# EAGLE design modulator (EAGLE 6.5.0)
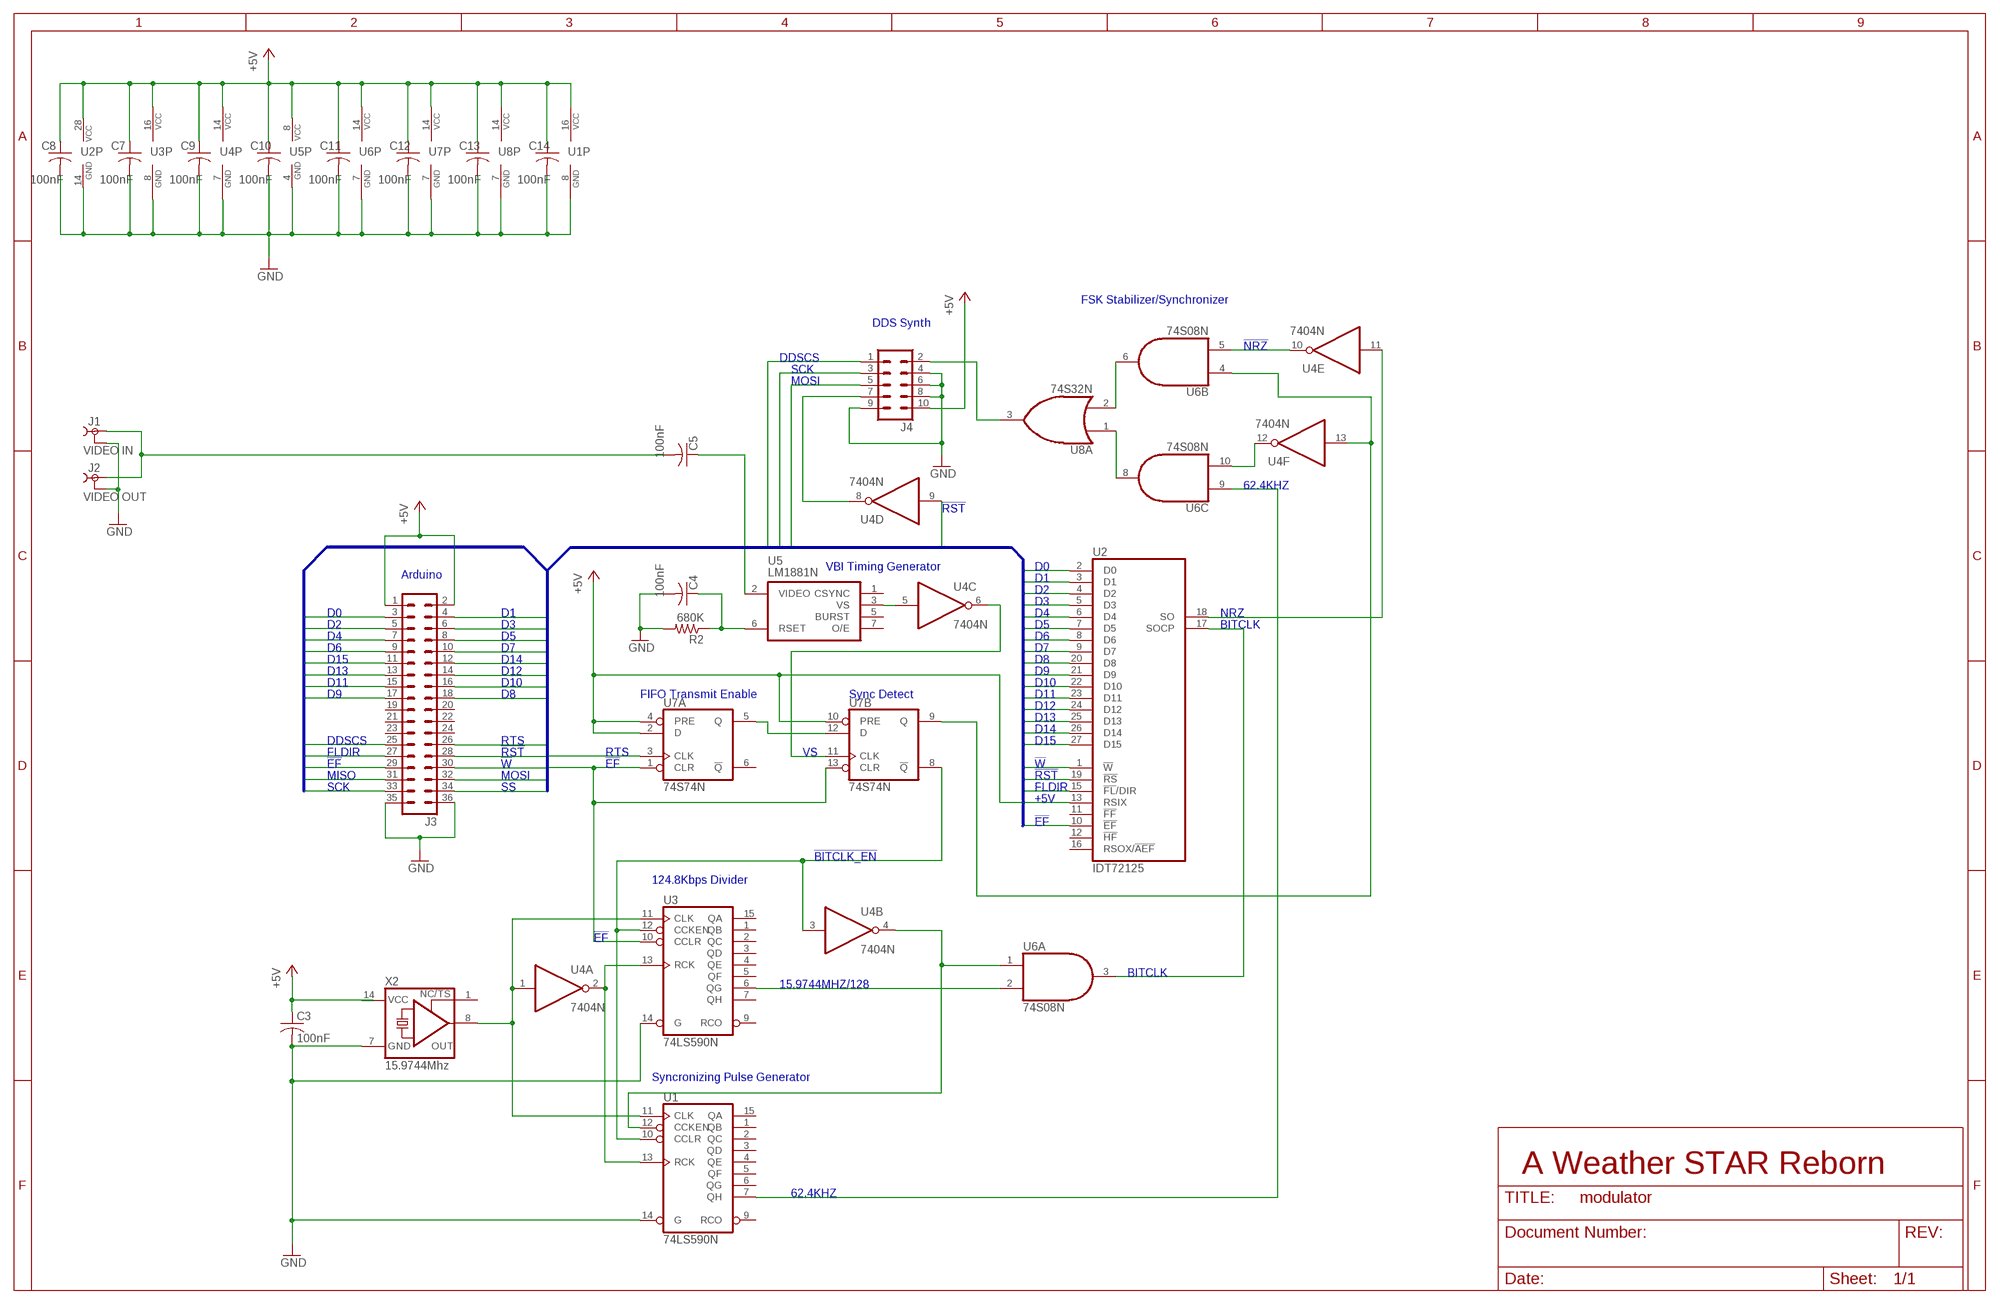
[diagram p0: schematic, sheet 1]

## Parts
C3  100nF  C-US050-025X075  [C050-025X075]
C4  100nF  C-US050-025X075  [C050-025X075]
C5  100nF  C-US050-025X075  [C050-025X075]
C7  100nF  C-US050-025X075  [C050-025X075]
C8  100nF  C-US050-025X075  [C050-025X075]
C9  100nF  C-US050-025X075  [C050-025X075]
C10  100nF  C-US050-025X075  [C050-025X075]
C11  100nF  C-US050-025X075  [C050-025X075]
C12  100nF  C-US050-025X075  [C050-025X075]
C13  100nF  C-US050-025X075  [C050-025X075]
C14  100nF  C-US050-025X075  [C050-025X075]
J1  VIDEO IN  TOBU3  [TOBU3]
J2  VIDEO OUT  TOBU3  [TOBU3]
J3  MA18-2  [MA18-2]
J4  MA05-2  [MA05-2]
R2  680K  R-US_0207/12  [0207/12]
U1  74LS590N  [DIL16]
U2  IDT72125  72125  [SO28L]
U3  74LS590N  [DIL16]
U4  7404N  [DIL14]
U5  LM1881N  [DIL08]
U6  74S08N  [DIL14]
U7  74S74N  [DIL14]
U8  74S32N  [DIL14]
X2  15.9744Mhz  XO-14  [DIL14S]

## Nets
15.9744MHZ/128: U3.6(QG) U6.2(A:I1)
62.4KHZ: U1.7(QH) U6.9(C:I0)
!BITCLK_EN: U1.10(CCLR) U3.12(CCKEN) U4.3(B:I) U7.8(B:!Q)
!EF: J3.29 U2.10(!EF) U3.10(CCLR) U7.1(A:CLR) U7.13(B:CLR)
!NRZ: U4.10(E:O) U6.5(B:I1)
!RST: J3.28 U2.19(!RS) U4.9(D:I)
!W: J3.30 U2.1(!W)
+5V: C3.1 C7.1 C8.1 C9.1 C10.1 C11.1 C12.1 C13.1 C14.1 J3.1 J3.2 J4.10 U1.16(VCC) U2.13(RSIX) U2.28(VCC) U3.16(VCC) U4.14(P:VCC) U5.8(VCC) U6.14(P:VCC) U7.2(A:D) U7.4(A:PRE) U7.10(B:PRE) U7.14(P:VCC) U8.14(P:VCC) X2.14(VCC)
BITCLK: U2.17(SOCP) U6.3(A:O)
D0: J3.3 U2.2(D0)
D1: J3.4 U2.3(D1)
D2: J3.5 U2.4(D2)
D3: J3.6 U2.5(D3)
D4: J3.7 U2.6(D4)
D5: J3.8 U2.7(D5)
D6: J3.9 U2.8(D6)
D7: J3.10 U2.9(D7)
D8: J3.18 U2.20(D8)
D9: J3.17 U2.21(D9)
D10: J3.16 U2.22(D10)
D11: J3.15 U2.23(D11)
D12: J3.14 U2.24(D12)
D13: J3.13 U2.25(D13)
D14: J3.12 U2.26(D14)
D15: J3.11 U2.27(D15)
DDSCS: J3.25 J4.1
FLDIR: J3.27 U2.15(!FL!/DIR)
GND: C3.2 C4.2 C7.2 C8.2 C9.2 C10.2 C11.2 C12.2 C13.2 C14.2 J1.2 J1.2@1 J1.2@2 J2.2 J2.2@1 J2.2@2 J3.35 J3.36 J4.4 J4.6 J4.8 J4.9 R2.2 U1.8(GND) U1.14(G) U2.14(GND) U3.8(GND) U3.14(G) U4.7(P:GND) U5.4(GND) U6.7(P:GND) U7.7(P:GND) U8.7(P:GND) X2.7(GND)
MISO: J3.31
MOSI: J3.32 J4.5
N$1: J4.7 U4.8(D:O)
N$2: J4.2 U8.3(A:O)
N$3: U1.11(CLK) U3.11(CLK) U4.1(A:I) X2.8(OUT)
N$4: U1.13(RCK) U3.13(RCK) U4.2(A:O)
N$5: U1.12(CCKEN) U4.4(B:O) U6.1(A:I0)
N$6: U4.13(F:I) U6.4(B:I0) U7.9(B:Q)
N$7: C5.2 J1.1 J2.1
N$8: U7.5(A:Q) U7.12(B:D)
N$9: U4.5(C:I) U5.3(VS)
N$10: U4.12(F:O) U6.10(C:I1)
N$11: C4.1 R2.1 U5.6(RSET)
N$12: U6.6(B:O) U8.2(A:I1)
N$13: C5.1 U5.2(VIDEO)
N$14: U6.8(C:O) U8.1(A:I0)
NRZ: U2.18(SO) U4.11(E:I)
RTS: J3.26 U7.3(A:CLK)
SCK: J3.33 J4.3
SS: J3.34
VS: U4.6(C:O) U7.11(B:CLK)
Unconnected: J3.19 J3.20 J3.21 J3.22 J3.23 J3.24 U1.1(QB) U1.2(QC) U1.3(QD) U1.4(QE) U1.5(QF) U1.6(QG) U1.9(RCO) U1.15(QA) U2.11(!FF) U2.12(!HF) U2.16(RSOX/!AEF) U3.1(QB) U3.2(QC) U3.3(QD) U3.4(QE) U3.5(QF) U3.7(QH) U3.9(RCO) U3.15(QA) U5.1(CSYNC) U5.5(BURST) U5.7(O/E) U6.11(D:O) U6.12(D:I0) U6.13(D:I1) U7.6(A:!Q) U8.4(B:I0) U8.5(B:I1) U8.6(B:O) U8.8(C:O) U8.9(C:I0) U8.10(C:I1) U8.11(D:O) U8.12(D:I0) U8.13(D:I1) X2.1(TS)

## Buses
D0,D1,D2,D3,D4,D5,D6,D7,D8,D9,D10,D11,D12,D13,D14,D15,!W,!EF,!RST,FLDIR,RTS,MOSI,MISO,SCK,SS,RFON,DDSCS

## Notes on the sheet
- FSK Stabilizer/Synchronizer
- DDS Synth
- VBI Timing Generator
- Arduino
- FIFO Transmit Enable | Sync Detect
- 124.8Kbps Divider
- Syncronizing Pulse Generator
- A Weather STAR Reborn

## Library data of the parts
C3-C5 C7-C14 = rcl:C-US: CAPACITOR, American symbol
J1 J2 = con-hirschmann custom:TOBU3: Female Cinch CONNECTOR ( RCA Jack ); MF: FARNELL; MPN: TOBU 3; OC_FARNELL: 592791; OC_NEWARK: 06WX5914
J3 = con-lstb:MA18-2: PIN HEADER; OC_FARNELL: unknown; OC_NEWARK: unknown
J4 = con-lstb:MA05-2: PIN HEADER; OC_FARNELL: unknown; OC_NEWARK: unknown
R2 = rcl:R-US_: RESISTOR, American symbol
U1 U3 = 74xx-us:74*590: 8-bit binary COUNTER, output register
U2 = mylib:72125: FIFO MEMORY
U4 = 74xx-us:74*04: Hex INVERTER
U5 = oldchips2:LM1881: Video sync separator
U6 = 74xx-us:74*08: Quad 2-input AND gate
U7 = 74xx-us:74*74: Dual D type positive edge triggered FLIP FLOP, preset and clear
U8 = 74xx-us:74*32: Quad 2-input OR gate
X2 = crystal:XO-: CRYSTAL; OC_FARNELL: unknown; OC_NEWARK: unknown

## Net classes
1 power: width 0.152 mm, drill 0.61 mm, clearance 0.152 mm
2 VIN: width 0.305 mm, drill 0.61 mm, clearance 0.152 mm

## Board
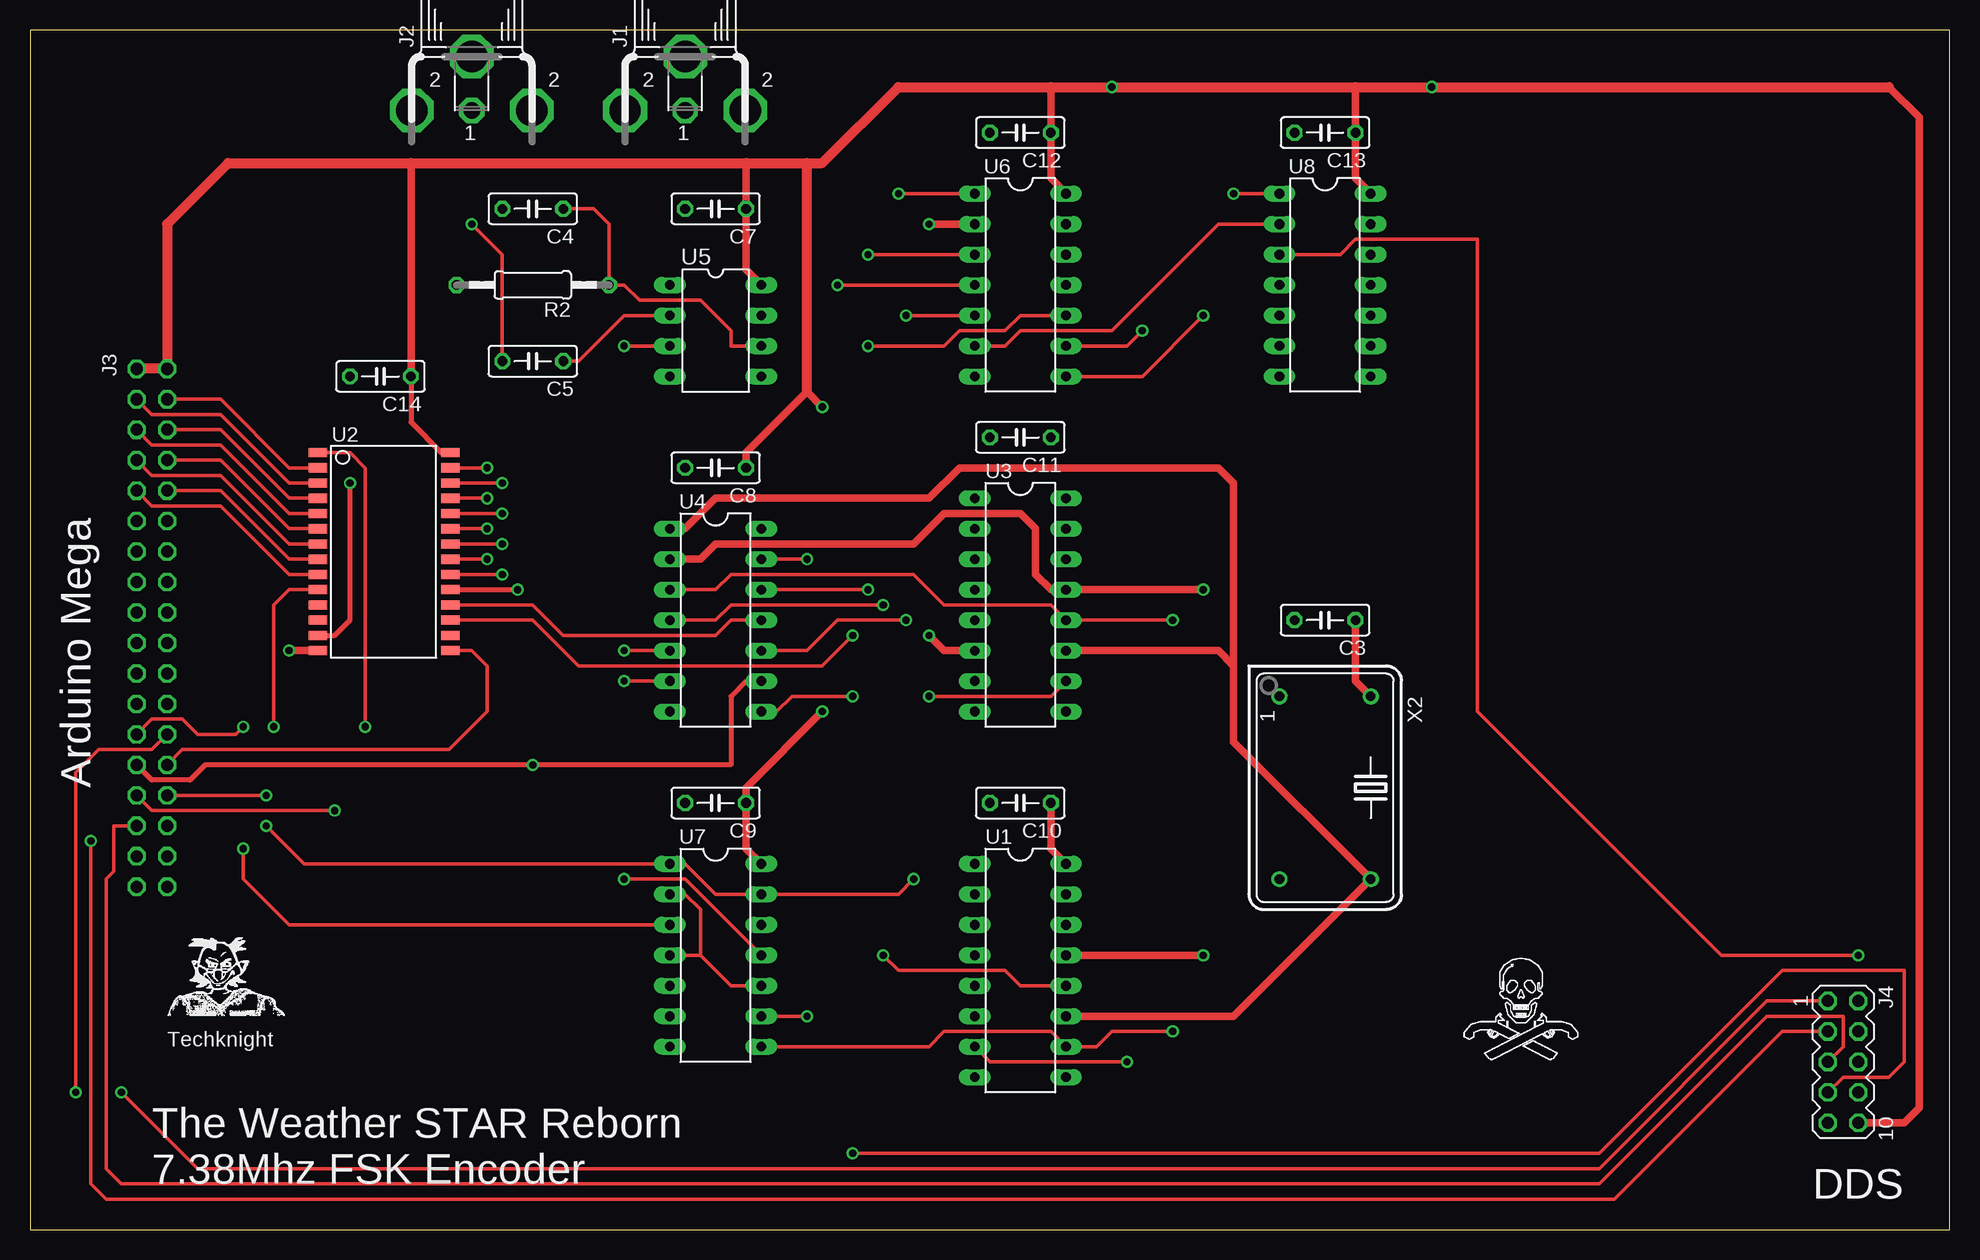
[diagram p1: board, top side]
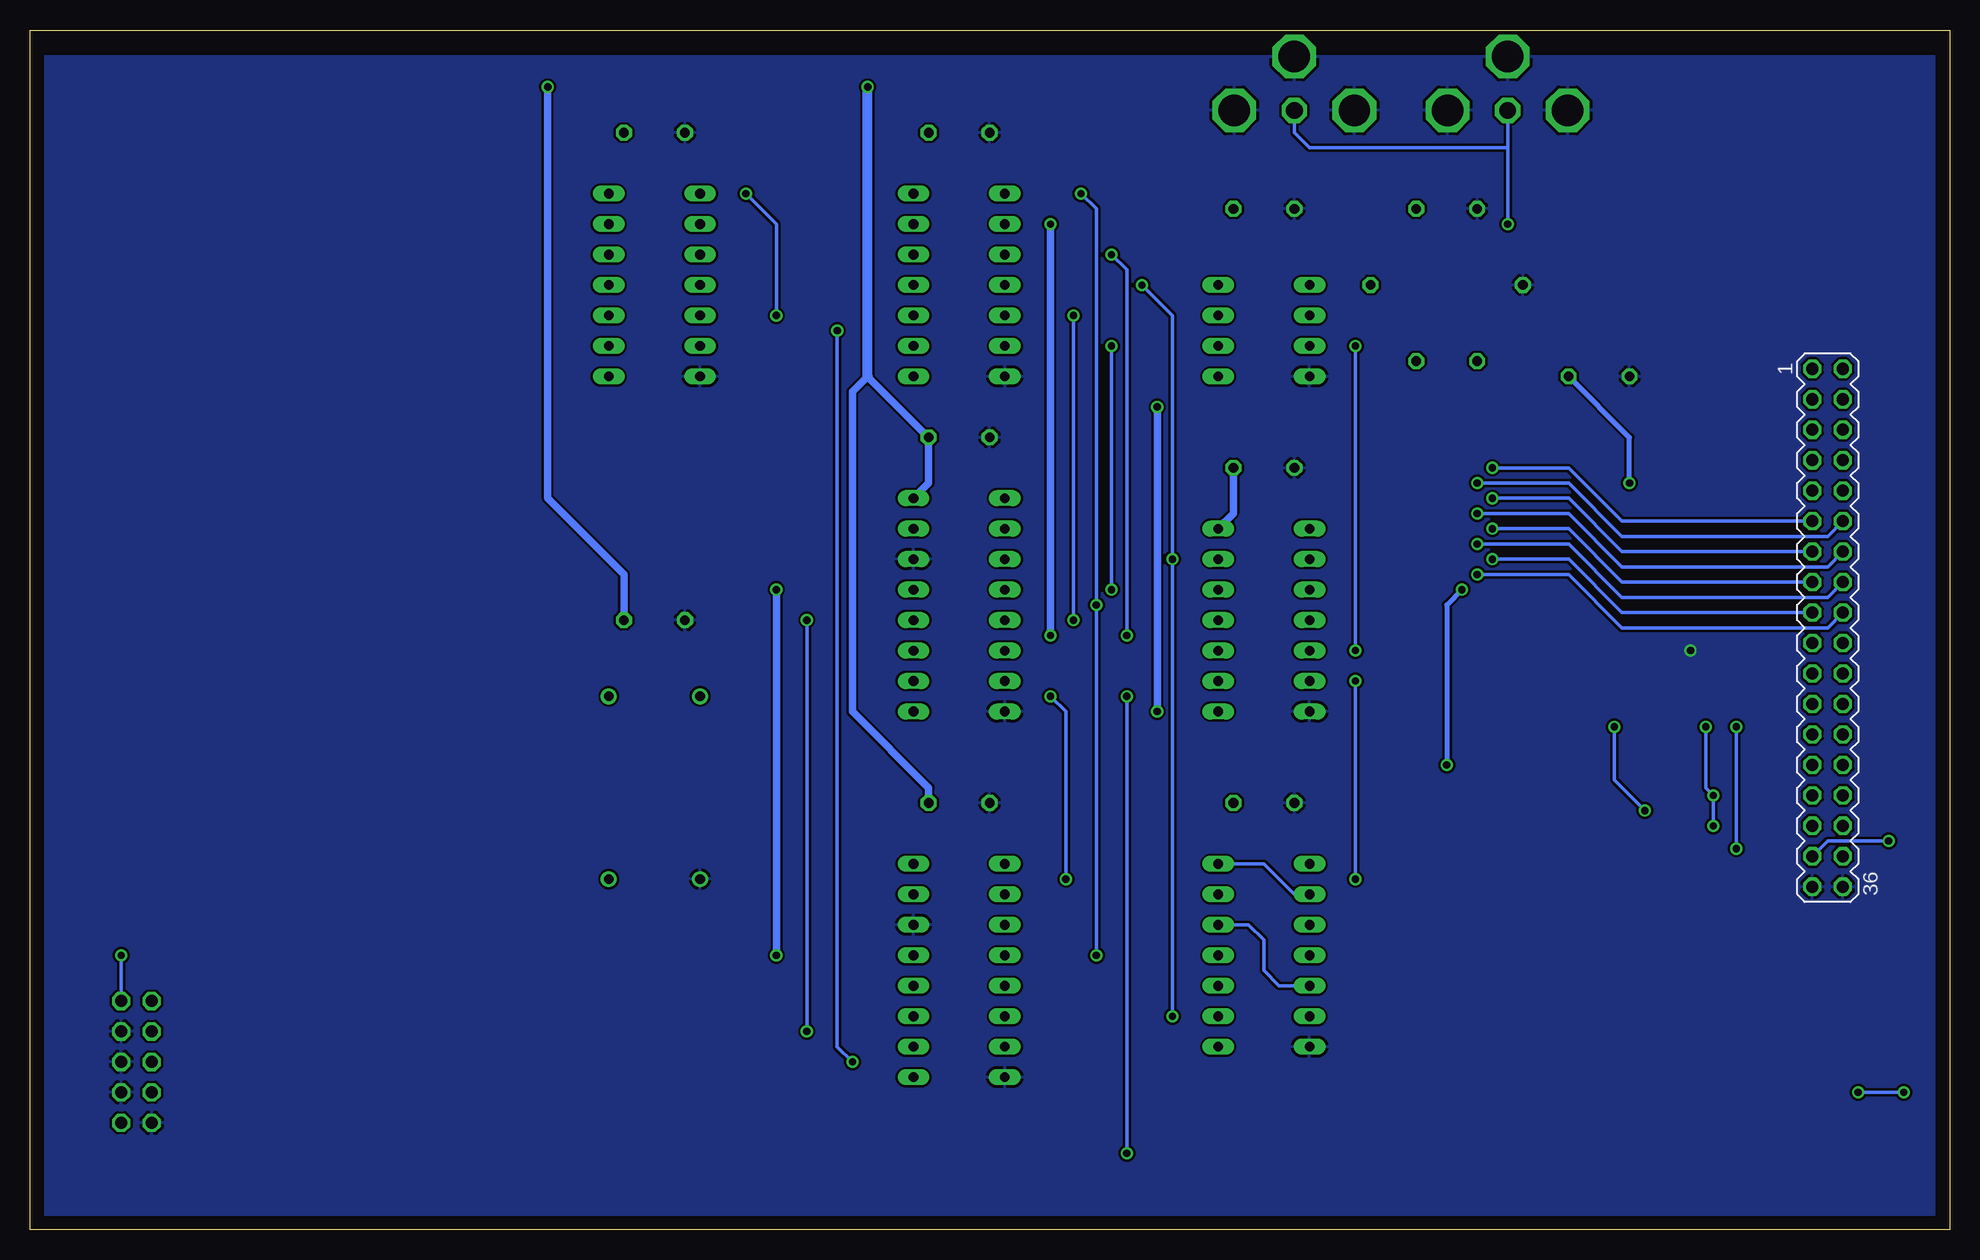
[diagram p2: board, bottom side, seen from below]

Size 160 x 100 mm. Coordinates in mm from the lower left corner, seen from the top.
Outline: 0,0 160,0 160,100 0,100 0,0
Copper layers (1*16): Top 0.035mm / dielectric 1.5mm / Bottom 0.035mm
Design rules "default *": minimum track width 10mil, minimum drill 24mil, track to track 8mil, track to pad 12mil, pad to pad 8mil, via to via 8mil, smd to smd 8mil, copper to edge 40mil, drill to drill 8mil, minimum pad ring 10mil, minimum via ring 8mil, stop-mask expansion 4mil, vias tented up to drill 0mil, thermal gap 10mil

### Footprints (pad centres in the part's own frame; a part is rotated, then mirrored left to right if it is on the bottom)
C050-025X075 = drill 0.813 octagon: 1 -2.54,0; 2 2.54,0
TOBU3 = drill 1.397 octagon: 1 0,0.584 | drill 2.616 octagon: 2 5.004,0.584; 2@1 -5.004,0.584; 2@2 0,5.08
MA18-2 = drill 1.016 octagon: 1 -21.59,-1.27; 2 -21.59,1.27; 3 -19.05,-1.27; 4 -19.05,1.27; 5 -16.51,-1.27; 6 -16.51,1.27; 7 -13.97,-1.27; 8 -13.97,1.27; 9 -11.43,-1.27; 10 -11.43,1.27; 11 -8.89,-1.27; 12 -8.89,1.27; 13 -6.35,-1.27; 14 -6.35,1.27; 15 -3.81,-1.27; 16 -3.81,1.27; 17 -1.27,-1.27; 18 -1.27,1.27; 19 1.27,-1.27; 20 1.27,1.27; 21 3.81,-1.27; 22 3.81,1.27; 23 6.35,-1.27; 24 6.35,1.27; 25 8.89,-1.27; 26 8.89,1.27; 27 11.43,-1.27; 28 11.43,1.27; 29 13.97,-1.27; 30 13.97,1.27; 31 16.51,-1.27; 32 16.51,1.27; 33 19.05,-1.27; 34 19.05,1.27; 35 21.59,-1.27; 36 21.59,1.27
MA05-2 = drill 1.016 octagon: 1 -5.08,-1.27; 2 -5.08,1.27; 3 -2.54,-1.27; 4 -2.54,1.27; 5 0,-1.27; 6 0,1.27; 7 2.54,-1.27; 8 2.54,1.27; 9 5.08,-1.27; 10 5.08,1.27
0207/12 = drill 0.813 octagon: 1 -6.35,0; 2 6.35,0
DIL16 = drill 0.813 long: 1 -8.89,-3.81; 2 -6.35,-3.81; 3 -3.81,-3.81; 4 -1.27,-3.81; 5 1.27,-3.81; 6 3.81,-3.81; 7 6.35,-3.81; 8 8.89,-3.81; 9 8.89,3.81; 10 6.35,3.81; 11 3.81,3.81; 12 1.27,3.81; 13 -1.27,3.81; 14 -3.81,3.81; 15 -6.35,3.81; 16 -8.89,3.81
SO28L = smd 0.762 x 1.524: 1 -7.62,-5.207; 2 -6.35,-5.207; 3 -5.08,-5.207; 4 -3.81,-5.207; 5 -2.54,-5.207; 6 -1.27,-5.207; 7 0,-5.207; 8 1.27,-5.207; 9 2.54,-5.207; 10 3.81,-5.207; 11 5.08,-5.207; 12 6.35,-5.207; 13 7.62,-5.207; 14 8.89,-5.207; 15 8.89,5.842; 16 7.62,5.842; 17 6.35,5.842; 18 5.08,5.842; 19 3.81,5.842; 20 2.54,5.842; 21 1.27,5.842; 22 0,5.842; 23 -1.27,5.842; 24 -2.54,5.842; 25 -3.81,5.842; 26 -5.08,5.842; 27 -6.35,5.842; 28 -7.62,5.842
DIL14 = drill 0.813 long: 1 -7.62,-3.81; 2 -5.08,-3.81; 3 -2.54,-3.81; 4 0,-3.81; 5 2.54,-3.81; 6 5.08,-3.81; 7 7.62,-3.81; 8 7.62,3.81; 9 5.08,3.81; 10 2.54,3.81; 11 0,3.81; 12 -2.54,3.81; 13 -5.08,3.81; 14 -7.62,3.81
DIL08 = drill 0.813 long: 1 -3.81,-3.81; 2 -1.27,-3.81; 3 1.27,-3.81; 4 3.81,-3.81; 5 3.81,3.81; 6 1.27,3.81; 7 -1.27,3.81; 8 -3.81,3.81
DIL14S = drill 0.813: 1 -7.62,-3.81; 7 7.62,-3.81; 8 7.62,3.81; 14 -7.62,3.81

### Placement (x,y rotation side)
C3  107.95,50.8 180 top
C4  41.91,85.09 180 top
C5  41.91,72.39 180 top
C7  57.15,85.09 180 top
C8  57.15,63.5 180 top
C9  57.15,35.56 180 top
C10  82.55,35.56 180 top
C11  82.55,66.04 180 top
C12  82.55,91.44 180 top
C13  107.95,91.44 180 top
C14  29.21,71.12 180 top
J1  54.61,92.71 0 top
J2  36.83,92.71 0 top
J3  10.16,50.16 270 bottom
J4  151.13,13.97 270 top
R2  41.91,78.74 180 top
U1  82.55,21.59 270 top
U2  29.21,57.15 270 top
U3  82.55,52.07 270 top
U4  57.15,50.8 270 top
U5  57.15,74.93 270 top
U6  82.55,78.74 270 top
U7  57.15,22.86 270 top
U8  107.95,78.74 270 top
U$1  [LOGO]  11.43,17.78 0 top
U$2  [JOLLYROGER]  119.38,13.97 0 top
X2  107.95,36.83 270 top

### Tracks (layer width: path | path; a pad name or v marks a point on that pad's centre or on a via)
15.9744MHZ/128  (via drill 0.6)
  Top 0.61: U3.6 76.2,48.26 v74.93,49.53 | v74.93,83.82 U6.2
  Bottom 0.61: v74.93,49.53 v74.93,83.82
62.4KHZ  (via drill 0.6)
  Top 0.305: U6.9 91.44,73.66 v92.71,74.93 | v91.44,13.97 80.01,13.97 U1.7
  Bottom 0.305: v92.71,74.93 92.71,15.24 v91.44,13.97
!BITCLK_EN  (via drill 0.6)
  Top 0.305: U7.8 74.93,15.24 76.2,16.51 85.09,16.51 U1.10 88.9,15.24 90.17,16.51 v95.25,16.51 | v95.25,50.8 U3.12 85.09,52.07 76.2,52.07 73.66,54.61 58.42,54.61 57.15,53.34 U4.3
  Bottom 0.305: v95.25,16.51 v95.25,50.8
!EF  (via drill 0.6)
  Top 0.305: U2.10 21.59,53.34 20.32,52.07 v20.32,41.91 | v19.68,36.2 J3.29 | v73.66,29.21 72.39,27.94 U7.13 57.15,27.94 54.61,30.48 U7.1 22.86,30.48 v19.68,33.66 | v74.93,44.45 85.09,44.45 U3.10
  Bottom 0.305: v20.32,41.91 20.32,36.83 v19.68,36.2 v19.68,33.66 | v73.66,29.21 73.66,43.18 v74.93,44.45
!NRZ  (via drill 0.6)
  Top 0.305: U4.10 64.77,48.26 67.31,50.8 v73.03,50.8 | v73.03,76.2 U6.5
  Bottom 0.305: v73.03,50.8 v73.03,76.2
!RST  (via drill 0.6)
  Top 0.406: U4.9 59.69,45.72 58.42,44.45 58.42,38.73 v41.91,38.73 14.61,38.73 13.34,37.47 10.16,37.47 J3.28 | U2.19 v40.64,53.34
  Bottom 0.406: v40.64,53.34 41.91,52.07 v41.91,38.73
!W  (via drill 0.6)
  Top 0.305: U2.1 26.67,64.77 27.94,63.5 v27.94,41.91 | v25.4,34.92 10.16,34.92 J3.30
  Bottom 0.305: v27.94,41.91 27.94,37.47 v25.4,34.92
+5V  (via drill 0.6)
  Top 0.305: U7.4 55.88,22.86 | 55.88,22.86 58.42,20.32 U7.10 | U7.2 54.61,27.94 55.88,26.67 55.88,22.86
  Top 0.406: C14.1 31.75,67.31 34.29,64.77 U2.28 | U2.13 25.4,49.53 26.67,50.8 v26.67,62.23
  Top 0.61: 59.69,88.9 C7.1 59.69,80.01 U5.8 | 85.09,95.25 C12.1 85.09,87.63 U6.14 | U8.14 110.49,87.63 C13.1 110.49,95.25 114.3,95.25 | C14.1 31.75,88.9 | U7.14 59.69,31.75 C9.1 59.69,36.83 v66.04,43.18 | C10.1 85.09,31.75 U1.16 | C8.1 59.69,64.77 64.77,69.85 v66.04,68.58 | C3.1 110.49,45.72 X2.14 | J4.10 156.21,8.89 157.48,10.16 157.48,92.71 154.94,95.25
  Top 0.813: 64.77,88.9 59.69,88.9 31.75,88.9 16.51,88.9 11.43,83.82 J3.1 J3.2 | 64.77,88.9 66.04,88.9 72.39,95.25 85.09,95.25 v90.17,95.25 110.49,95.25 v116.84,95.25 154.94,95.25 | 64.77,69.85 64.77,88.9
  Bottom 0.305: U7.14 57.15,30.48 54.61,27.94 U7.2
  Bottom 0.406: v26.67,62.23 26.67,66.04 C14.1
  Bottom 0.61: C8.1 59.69,59.69 U4.14 | U3.16 85.09,62.23 C11.1 90.17,71.12 91.44,69.85 91.44,43.18 85.09,36.83 C10.1 | v66.04,43.18 v66.04,68.58 | C3.1 110.49,54.61 116.84,60.96 v116.84,95.25
  Bottom 0.813: 90.17,71.12 v90.17,95.25
BITCLK  (via drill 0.6)
  Top 0.305: U2.17 41.91,50.8 45.72,46.99 66.04,46.99 v68.58,49.53 | v69.85,81.28 U6.3
  Bottom 0.305: v68.58,49.53 68.58,80.01 v69.85,81.28
D0
  Top 0.305: U2.2 21.59,63.5 15.88,69.22 J3.3
D1
  Top 0.305: U2.3 21.59,62.23 15.88,67.94 10.16,67.94 J3.4
D2
  Top 0.305: U2.4 21.59,60.96 15.88,66.67 J3.5
D3
  Top 0.305: U2.5 21.59,59.69 15.88,65.41 10.16,65.41 J3.6
D4
  Top 0.305: U2.6 21.59,58.42 15.88,64.14 J3.7
D5
  Top 0.305: U2.7 21.59,57.15 15.88,62.87 10.16,62.87 J3.8
D6
  Top 0.305: U2.8 21.59,55.88 15.88,61.59 J3.9
D7
  Top 0.305: U2.9 21.59,54.61 15.88,60.33 10.16,60.33 J3.10
D8  (via drill 0.6)
  Top 0.305: v39.37,54.61 U2.20
  Bottom 0.305: v39.37,54.61 31.75,54.61 27.3,50.16 10.16,50.16 J3.18
D9  (via drill 0.6)
  Top 0.305: v38.1,55.88 U2.21
  Bottom 0.305: v38.1,55.88 31.75,55.88 27.3,51.44 J3.17
D10  (via drill 0.6)
  Top 0.305: v39.37,57.15 U2.22
  Bottom 0.305: v39.37,57.15 31.75,57.15 27.3,52.7 10.16,52.7 J3.16
D11  (via drill 0.6)
  Top 0.305: v38.1,58.42 U2.23
  Bottom 0.305: v38.1,58.42 31.75,58.42 27.3,53.98 J3.15
D12  (via drill 0.6)
  Top 0.305: v39.37,59.69 U2.24
  Bottom 0.305: v39.37,59.69 31.75,59.69 27.3,55.24 10.16,55.24 J3.14
D13  (via drill 0.6)
  Top 0.305: v38.1,60.96 U2.25
  Bottom 0.305: v38.1,60.96 31.75,60.96 27.3,56.52 J3.13
D14  (via drill 0.6)
  Top 0.305: v39.37,62.23 U2.26
  Bottom 0.305: v39.37,62.23 31.75,62.23 27.3,57.78 10.16,57.78 J3.12
D15  (via drill 0.6)
  Top 0.305: v38.1,63.5 U2.27
  Bottom 0.305: v38.1,63.5 31.75,63.5 27.3,59.05 J3.11
DDSCS  (via drill 0.6)
  Top 0.305: v3.81,11.43 3.81,38.1 5.71,40.01 10.16,40.01 J3.25 | v7.62,11.43 13.97,5.08 130.81,5.08 144.78,19.05 J4.1
  Bottom 0.305: v3.81,11.43 v7.62,11.43
FLDIR
  Top 0.305: U2.15 36.83,48.26 38.1,46.99 38.1,43.18 34.92,40.01 12.7,40.01 J3.27
GND  (via drill 0.6)
  Top 0.61: U2.14 v21.59,48.26
  pour Bottom: 1.27,97.79 158.75,97.79 158.75,1.27 1.27,1.27
MOSI
  Top 0.305: J4.5 151.13,15.24 151.13,17.78 144.78,17.78 130.81,3.81 7.62,3.81 6.35,5.08 6.35,29.21 6.99,29.84 6.99,33.66 J3.32
N$1  (via drill 0.6)
  Top 0.305: U4.8 62.23,43.18 63.5,44.45 v68.58,44.45 | v68.58,6.35 130.81,6.35 146.05,21.59 156.21,21.59 156.21,13.97 154.94,12.7 151.13,12.7 J4.7
  Bottom 0.305: v68.58,44.45 v68.58,6.35
N$2  (via drill 0.6)
  Top 0.305: U8.3 109.22,81.28 110.49,82.55 120.65,82.55 120.65,43.18 140.97,22.86 v152.4,22.86
  Bottom 0.305: v152.4,22.86 J4.2
N$3
  Top 0.61: U1.11 100.33,17.78 X2.8 100.33,40.64 100.33,46.99 | U3.11 99.06,48.26 100.33,46.99 | U4.1 54.61,58.42 57.15,60.96 74.93,60.96 77.47,63.5 99.06,63.5 100.33,62.23 100.33,46.99
N$4  (via drill 0.6)
  Top 0.61: v97.79,53.34 U3.13 85.09,53.34 83.82,54.61 83.82,58.42 82.55,59.69 76.2,59.69 73.66,57.15 57.15,57.15 55.88,55.88 U4.2 | v97.79,22.86 U1.13
  Bottom 0.61: v97.79,53.34 v97.79,22.86
N$5  (via drill 0.6)
  Top 0.305: U4.4 57.15,50.8 58.42,52.07 v71.12,52.07 | v72.39,86.36 U6.1 | U1.12 82.55,20.32 81.28,21.59 72.39,21.59 v71.12,22.86
  Bottom 0.305: v72.39,86.36 71.12,85.09 v71.12,52.07 v71.12,22.86
N$6  (via drill 0.6)
  Top 0.305: U7.9 v64.77,17.78 | v64.77,55.88 U4.13 | v67.31,78.74 U6.4
  Bottom 0.305: v64.77,17.78 v64.77,55.88 64.77,76.2 v67.31,78.74
N$7  (via drill 0.6)
  Top 0.305: C5.2 39.37,81.28 v36.83,83.82
  Bottom 0.305: v36.83,83.82 36.83,90.17 | 36.83,90.17 J2.1 | J1.1 54.61,91.44 53.34,90.17 36.83,90.17
N$8
  Bottom 0.305: U7.5 55.88,20.32 57.15,21.59 57.15,24.13 58.42,25.4 U7.12
N$9  (via drill 0.6)
  Top 0.305: U4.5 v49.53,48.26 | v49.53,73.66 U5.3
  Bottom 0.305: v49.53,48.26 v49.53,73.66
N$10  (via drill 0.6)
  Top 0.305: U4.12 v69.85,53.34 | v69.85,73.66 76.2,73.66 77.47,74.93 81.28,74.93 82.55,76.2 U6.10
  Bottom 0.305: v69.85,53.34 v69.85,73.66
N$11
  Top 0.305: C4.1 46.99,85.09 48.26,83.82 R2.1 49.53,78.74 50.8,77.47 55.88,77.47 58.42,74.93 58.42,73.66 U5.6
N$12
  Top 0.305: U6.6 81.28,73.66 82.55,74.93 90.17,74.93 99.06,83.82 U8.2
N$13
  Top 0.305: C5.1 45.72,72.39 49.53,76.2 U5.2
N$14  (via drill 0.6)
  Top 0.305: U6.8 92.71,71.12 v97.79,76.2 | v100.33,86.36 U8.1
  Bottom 0.305: v97.79,76.2 97.79,83.82 v100.33,86.36
NRZ
  Top 0.305: U2.18 41.91,52.07 44.45,49.53 57.15,49.53 58.42,50.8 U4.11
RTS  (via drill 0.6)
  Top 0.305: v17.78,41.91 17.14,41.27 13.97,41.27 12.7,42.55 10.16,42.55 J3.26 | v17.78,31.75 17.78,29.21 21.59,25.4 U7.3
  Bottom 0.305: v17.78,41.91 v17.78,31.75
SCK  (via drill 0.6)
  Top 0.305: v5.08,32.38 5.08,3.81 6.35,2.54 132.08,2.54 146.05,16.51 J4.3
  Bottom 0.305: v5.08,32.38 10.16,32.38 J3.33
VS  (via drill 0.6)
  Top 0.305: U7.11 54.61,29.21 v49.53,29.21 | v49.53,45.72 U4.6
  Bottom 0.305: v49.53,29.21 v49.53,45.72

### Text on the board
tPlace: Arduino Mega | Techknight | The Weather STAR Reborn / 7.38Mhz FSK Encoder | DDS